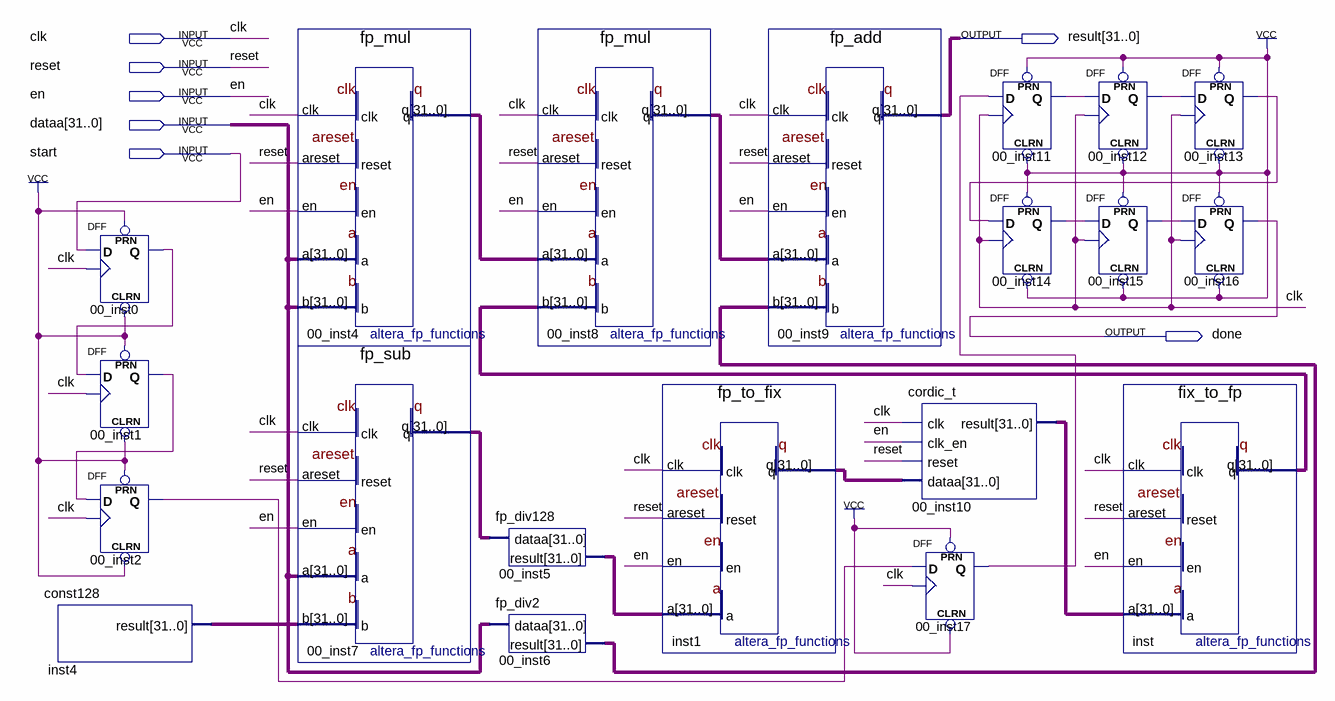
[diagram p0: schematic sheet]
// Quartus schematic fullfunction_t.bdf as structural Verilog: 20 symbols, 7 pins
module fullfunction_t (
  input  clk,
  input  reset,
  input  en,
  input  [31:0] dataa,
  input  start,
  output [31:0] result,
  output done
);

  wire n00_inst0_q, n00_inst1_q, n00_inst2_q, n00_inst11_q, n00_inst12_q, n00_inst13_q, n00_inst14_q,
       n00_inst15_q, n00_inst17_q;
  wire [31:0] inst1_q, inst4_result, inst_q, n00_inst4_q, n00_inst5_result, n00_inst6_result, n00_inst7_q,
       n00_inst8_q, n00_inst10_result;

  DFF u_00_inst0 (.CLRN(1'b1), .CLK(clk), .D(start), .PRN(1'b1), .Q(n00_inst0_q));
  DFF u_00_inst1 (.CLRN(1'b1), .CLK(clk), .D(n00_inst0_q), .PRN(1'b1), .Q(n00_inst1_q));
  DFF u_00_inst2 (.CLRN(1'b1), .CLK(clk), .D(n00_inst1_q), .PRN(1'b1), .Q(n00_inst2_q));
  const128 inst4 (.result(inst4_result));
  fp_mul u_00_inst4 (.clk(clk), .areset(reset), .en(en), .a(dataa), .b(dataa), .q(n00_inst4_q));
  fp_sub u_00_inst7 (.clk(clk), .areset(reset), .en(en), .a(dataa), .b(inst4_result), .q(n00_inst7_q));
  fp_mul u_00_inst8 (.clk(clk), .areset(reset), .en(en), .a(n00_inst4_q), .b(inst_q), .q(n00_inst8_q));
  fp_div128 u_00_inst5 (.dataa(n00_inst7_q), .result(n00_inst5_result));
  fp_div2 u_00_inst6 (.dataa(dataa), .result(n00_inst6_result));
  fp_to_fix inst1 (.clk(clk), .areset(reset), .en(en), .a(n00_inst5_result), .q(inst1_q));
  fp_add u_00_inst9 (.clk(clk), .areset(reset), .en(en), .a(n00_inst8_q), .b(n00_inst6_result), .q(result));
  cordic_t u_00_inst10 (.clk(clk), .clk_en(en), .reset(reset), .dataa(inst1_q), .result(n00_inst10_result));
  DFF u_00_inst17 (.CLRN(1'b1), .CLK(clk), .D(n00_inst2_q), .PRN(1'b1), .Q(n00_inst17_q));
  DFF u_00_inst11 (.CLRN(1'b1), .CLK(clk), .D(n00_inst17_q), .PRN(1'b1), .Q(n00_inst11_q));
  DFF u_00_inst14 (.CLRN(1'b1), .CLK(clk), .D(n00_inst13_q), .PRN(1'b1), .Q(n00_inst14_q));
  DFF u_00_inst12 (.CLRN(1'b1), .CLK(clk), .D(n00_inst11_q), .PRN(1'b1), .Q(n00_inst12_q));
  DFF u_00_inst15 (.CLRN(1'b1), .CLK(clk), .D(n00_inst14_q), .PRN(1'b1), .Q(n00_inst15_q));
  fix_to_fp inst (.clk(clk), .areset(reset), .en(en), .a(n00_inst10_result), .q(inst_q));
  DFF u_00_inst13 (.CLRN(1'b1), .CLK(clk), .D(n00_inst12_q), .PRN(1'b1), .Q(n00_inst13_q));
  DFF u_00_inst16 (.CLRN(1'b1), .CLK(clk), .D(n00_inst15_q), .PRN(1'b1), .Q(done));
endmodule
